# Altium project Flyback converter.PrjPcb
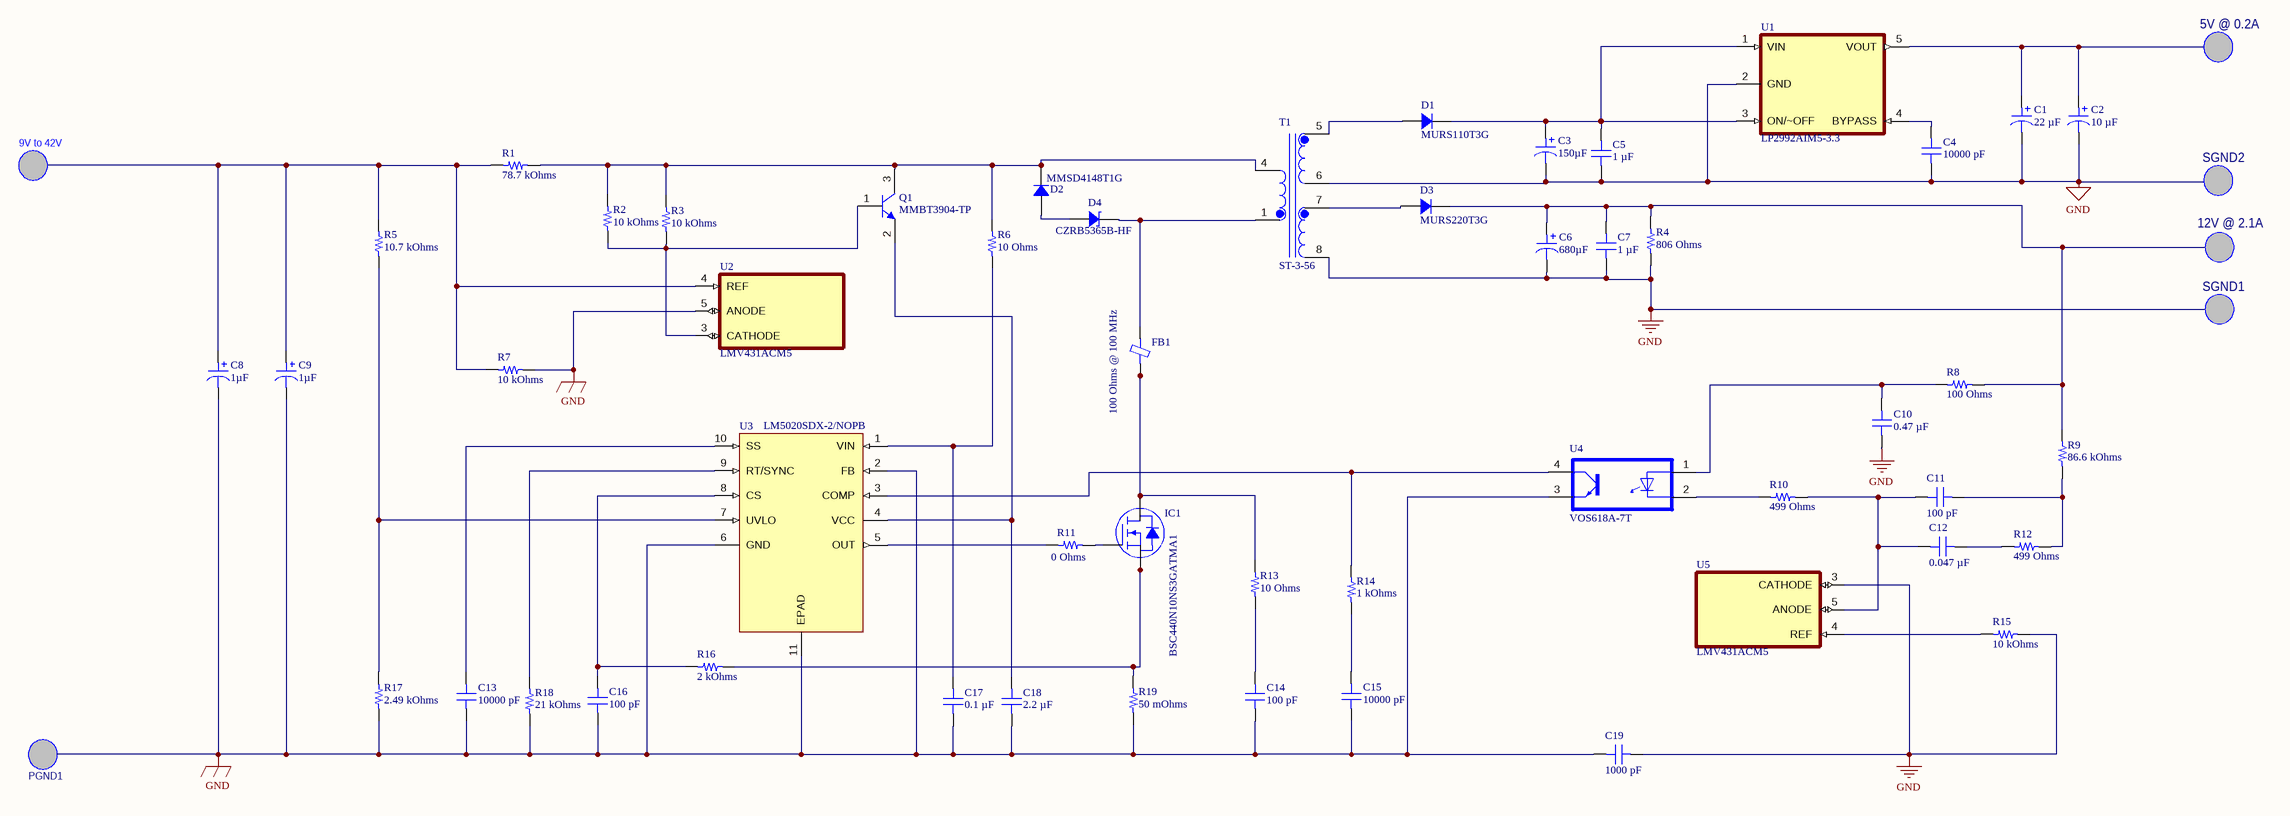
[diagram p0: Flyback Converter SCHEMATIC.SchDoc]
1 sheet, 51 parts. Net scope: global (net labels, ports and power ports of the same name join across sheets).
Board file: Flyback Converter PCB.PcbDoc

## Sheet Flyback Converter SCHEMATIC.SchDoc
size 594 x 420 mm; SheetNumber: 1; SheetTotal: 1

### Parts
C1  22 µF  [CAP AL TH D8 L3.5 H12.5]
C2  10 µF  [CAP AL TH D8 L3.5 H12.5]
C3  150µF  [CAP TH ALUM ELEC D8.00mm S3.50mm H13.00mm]
C4  10000 pF  [CAP 1206_3216 - 0.8MM]
C5  1 µF  [CAP 1206_3216 - 0.8MM]
C6  680µF  [CAP TH ALUM ELEC D10.00mm S5.00mm H14.00mm]
C7  1 µF  [CAP 1206_3216 - 0.8MM]
C8  1µF  [CAP TH ALUM ELEC D5.00mm S2.00mm H12.50mm]
C9  1µF  [CAP TH ALUM ELEC D5.00mm S2.00mm H12.50mm]
C10  0.47 µF  [CAP 1206_3216 - 0.8MM]
C11  100 pF  [CAP 1206_3216 - 0.8MM]
C12  0.047 µF  [CAP 1206_3216 - 0.8MM]
C13  10000 pF  [CAP 1206_3216 - 0.8MM]
C14  100 pF  [CAP 1206_3216 - 0.8MM]
C15  10000 pF  [CAP 1206_3216 - 0.8MM]
C16  100 pF  [CAP 1206_3216 - 0.8MM]
C17  0.1 µF  [CAP 1206_3216 - 0.8MM]
C18  2.2 µF  [CAP 1206_3216 - 0.8MM]
C19  1000 pF  [CAP 1206_3216 - 0.8MM]
D1  MURS110T3G  [DO214AA SMB]
D2  MMSD4148T1G  [SOD-123]
D3  MURS220T3G  [DO214AA SMB]
D4  CZRB5365B-HF  [DO214AA SMB]
FB1  100 Ohms @ 100 MHz  [FER 1206_3216]
IC1  BSC440N10NS3GATMA1  [INFINEON PG-TDSON-8 6.15X5.32MM]
Q1  MMBT3904-TP  [MCCSEMI SOT-23-3]
R1  78.7 kOhms  [RES 1206_3216]
R2  10 kOhms  [RES 1206_3216]
R3  10 kOhms  [RES 1206_3216]
R4  806 Ohms  [RES 1206_3216]
R5  10.7 kOhms  [RES 1206_3216]
R6  10 Ohms  [RES 1206_3216]
R7  10 kOhms  [RES 1206_3216]
R8  100 Ohms  [RES 1206_3216]
R9  86.6 kOhms  [RES 1206_3216]
R10  499 Ohms  [RES 1206_3216]
R11  0 Ohms  [RES 1206_3216]
R12  499 Ohms  [RES 1206_3216]
R13  10 Ohms  [RES 1206_3216]
R14  1 kOhms  [RES 1206_3216]
R15  10 kOhms  [RES 1206_3216]
R16  2 kOhms  [RES 1206_3216]
R17  2.49 kOhms  [RES 1206_3216]
R18  21 kOhms  [RES 1206_3216]
R19  50 mOhms  [RES 1206_3216]
T1  ST-3-56  [flyback tranformer]
U1  LP2992AIM5-3.3  [SOT95P280X145-5N]
U2  LMV431ACM5  [SOT95P280X145-5N]
U3  LM5020SDX-2/NOPB  [DFN400X400X80-11N]
U4  VOS618A-7T  [SOIC127P700X210-4N]
U5  LMV431ACM5  [SOT95P280X145-5N]

### Nets
GND: C1.2 C2.2 C3.2 C4.1 C5.1 C6.2 C7.1 C8.2 C9.2 C10.1 C13.1 C14.1 C15.1 C16.1 C17.1 C18.1 C19.1 C19.2 R4.1 R7.2 R15.1 R17.1 R18.1 R19.1 T1.6 T1.8 U1.2(GND) U2.5(ANODE) U3.2(FB) U3.6(GND) U3.11(EPAD) U4.3(E) U5.3(CATHODE)
NetC1_1: C1.1 C2.1 U1.5(VOUT)
NetC3_1: C3.1 C5.2 D1.2 U1.1(VIN) U1.3(ON/~OFF)
NetC4_2: C4.2 U1.4(BYPASS)
NetC6_1: C6.1 C7.2 D3.2 R4.2 R8.1 R9.2
NetC8_1: C8.1 C9.1 R1.1 R5.2 R7.1 U2.4(REF)
NetC10_2: C10.2 R8.2 U4.1(A)
NetC11_1: C11.1 C12.1 R10.2 U5.5(ANODE)
NetC11_2: C11.2 R9.1 R12.2
NetC12_2: C12.2 R12.1
NetC13_2: C13.2 U3.10(SS)
NetC14_2: C14.2 R13.1
NetC15_2: C15.2 R14.1
NetC16_2: C16.2 R16.1 U3.8(CS)
NetC17_2: C17.2 R6.1 U3.1(VIN)
NetC18_2: C18.2 Q1.2(E) U3.4(VCC)
NetD1_1: D1.1 T1.5
NetD2_1: D2.1 D4.1
NetD2_2: D2.2 Q1.3(C) R1.2 R2.2 R3.2 R6.2 T1.4
NetD3_1: D3.1 T1.7
NetD4_2: D4.2 FB1.2 T1.1
NetFB1_1: FB1.1 IC1.5(D) IC1.6(D) IC1.7(D) IC1.8(D) R13.2
NetIC1_1: IC1.1(S) IC1.2(S) IC1.3(S) R16.2 R19.2
NetIC1_4: IC1.4(G) R11.2
NetQ1_1: Q1.1(B) R2.1 R3.1 U2.3(CATHODE)
NetR5_1: R5.1 R17.2 U3.7(UVLO)
NetR10_1: R10.1 U4.2(C)
NetR11_1: R11.1 U3.5(OUT)
NetR14_2: R14.2 U3.3(COMP) U4.4(CO)
NetR15_2: R15.2 U5.4(REF)
NetR18_2: R18.2 U3.9(RT/SYNC)

### Notes on the sheet
- 5V @ 0.2A
- 9V to 42V
- SGND2
- 12V @ 2.1A
- SGND1
- PGND1
- DWG NO:
- REV:
- THIS DOCUMENT AND THE DATA DISCLOSED HEREIN OR
- HEREWITH IS THE PROPERTY OF ALTIUM LIMITED AND MAY
- BE FREELY DISTRIBUTED IN WHOLE. NO RIGHTS ARE
- RESERVED OR EXPRESS OR IMPLIED WARANTEE GIVEN.
- REVISION
- DESCRIPTION
- DATE
- APPROVED
- ENG:
- APPROVALS
- PROJECT
- DSN:
- CHK:
- REFERENCE DOCUMENTS
- PROJECT REVISION:
- TITLE
- DOCUMENT REVISION:
- DESIGN ITEM:
- BOM:
- FAB DWG:
- PCB DWG:
- ASSY DWG:
- SCALE:
- A2
- SIZE
- CAGE CODE
- FILE NAME
- DWG NO.
- SHEET
- OF
- REV

### Library data of the parts
C1 = UPJ2A220MPD: CAP ALUM 22UF 20% 100V RADIAL; manufacturer: Nichicon; Impedance: 550 mOhms; Lifetime @ Temp.: 3000 Hrs @ 105°C; Polarization: Polar; Ripple Current @ High Frequency: 230 mA @ 10 kHz; Ripple Current @ Low Frequency: 122 mA @ 120 Hz; Part Number: UPJ2A220MPD; Applications: General Purpose; Capacitance: 22 µF; componentlink1description: Datasheet; componentlink1url: http://nichicon-us.com/english/products/pdfs/e-upj.pdf; componentlink2description: DigiKey Link; componentlink2url: https://www.digikey.com/en/products/detail/nichicon/UPJ2A220MPD/2599356; Device Package: Radial, Can; Height - Seated (Max): 0.492" (12.50mm); lastupdated: 27.08.2022 08:22:19; Lead Spacing: 0.138" (3.50mm); Lifecycle Status: Active; Minimum Order: 1; Mounting Type: Through Hole; Operating Temperature: -55°C ~ 105°C; Package / Case: Radial, Can; packaging: Bulk; partid: 7301; Part Status: Active; price: 0.15; series: UPJ; Size / Dimension: 0.315" Dia (8.00mm); Supplier 1: DigiKey; Supplier Part Number 1: 493-15683-ND; Tolerance: ±20%; value: 22 µF; Voltage - Rated: 100 V
C2 = UKL2A100MPD1TD: CAP ALUM 10UF 20% 100V RADIAL; manufacturer: Nichicon; Lifetime @ Temp.: 2000 Hrs @ 85°C; Polarization: Polar; Ripple Current @ High Frequency: 180 mA @ 10 kHz; Ripple Current @ Low Frequency: 90 mA @ 120 Hz; Part Number: UKL2A100MPD1TD; Applications: General Purpose; Capacitance: 10 µF; componentlink1description: Datasheet; componentlink1url: http://nichicon-us.com/english/products/pdfs/e-ukl.pdf; componentlink2description: DigiKey Link; componentlink2url: https://www.digikey.com/en/products/detail/nichicon/UKL2A100MPD1TD/4317213; Device Package: Radial, Can; Height - Seated (Max): 0.492" (12.50mm); lastupdated: 27.08.2022 08:22:20; Lead Spacing: 0.138" (3.50mm); Lifecycle Status: Active; Minimum Order: 1; Mounting Type: Through Hole; Operating Temperature: -40°C ~ 85°C; Package / Case: Radial, Can; packaging: TapeAndBox; partid: 7259; Part Status: Active; price: 0.18; series: UKL; Size / Dimension: 0.315" Dia (8.00mm); Supplier 1: DigiKey; Supplier Part Number 1: 493-10590-1-ND; Tolerance: ±20%; value: 10 µF; Voltage - Rated: 100 V
C3 = EKZE350ELL151MHB5D: CAP ALUM 150UF 20% 35V RADIAL; manufacturer: United Chemi-Con; Impedance: 72 mOhms; Lifetime @ Temp.: 3000 Hrs @ 105°C; Polarization: Polar; Ripple Current @ High Frequency: 760mA @ 100kHz; Ripple Current @ Low Frequency: 304mA @ 120Hz; Part Number: EKZE350ELL151MHB5D; Applications: General Purpose; Capacitance: 150µF; componentlink1description: Datasheet; componentlink1url: http://www.chemi-con.co.jp/cgi-bin/CAT_DB/SEARCH/cat_db_al.cgi?e=e&j=p&pdfname=kze; componentlink2description: DigiKey Link; componentlink2url: http://digikey.com/product-detail/en/united-chemi-con/EKZE350ELL151MHB5D/565-1689-ND/756205; Device Package: Radial, Can; Height - Seated (Max): 0.512" (13.00mm); lastupdated: 7.09.2020 05:24:55; Lead Spacing: 0.138" (3.50mm); Lifecycle Status: Active; Minimum Order: 1; Mounting Type: Through Hole; Operating Temperature: -40°C ~ 105°C; Package / Case: Radial, Can; packaging: Bulk; partid: 24171; Part Status: Active; price: 0.45; series: KZE; Size / Dimension: 0.315" Dia (8.00mm); Supplier 1: DigiKey; Supplier Part Number 1: 565-1689-ND; Tolerance: ±20%; value: 150µF; Voltage - Rated: 35V
C4 C13 C15 = C1206C103K2REC7800: CAP CER 1206 10NF 200V X7R 10%; manufacturer: KEMET; Part Number: C1206C103K2REC7800; Value: 10000 pF; Applications: ESD Protection; Capacitance: 10000 pF; componentlink1description: Datasheet; componentlink1url: https://api.kemet.com/component-edge/download/datasheet/C1206C103K2REC7800.pdf; componentlink2description: DigiKey Link; componentlink2url: https://www.digikey.com/en/products/detail/kemet/C1206C103K2REC7800/8644233; Device Package: 1206 (3216 Metric); lastupdated: 27.08.2022 07:36:50; Lifecycle Status: Active; Minimum Order: 1; Mounting Type: Surface Mount, MLCC; Operating Temperature: -55°C ~ 125°C; Package / Case: 1206 (3216 Metric); packaging: TapeAndReel; partid: 30339; Part Status: Active; price: 0.03; series: ESD SMD Comm X7R; Size / Dimension: 0.126" L x 0.063" W (3.20mm x 1.60mm); Supplier 1: DigiKey; Supplier Part Number 1: 399-C1206C103K2REC7800CT-ND; Temperature Coefficient: X7R; Thickness (Max): 0.035" (0.88mm); Tolerance: ±10%; Voltage - Rated: 200V
C5 C7 = C1206C105K1RACAUTO: CAP CER 1UF 100V X7R 1206; manufacturer: KEMET; Tolerance: ±10%; Part Number: C1206C105K1RACAUTO; Value: 1 µF; Applications: Automotive, Bypass, Decoupling; Capacitance: 1 µF; componentlink1description: Datasheet; componentlink1url: https://api.kemet.com/component-edge/download/datasheet/C1206C105K1RACAUTO.pdf; componentlink2description: DigiKey Link; componentlink2url: https://www.digikey.com/en/products/detail/kemet/C1206C105K1RACAUTO/6108922; Device Package: 1206 (3216 Metric); lastupdated: 27.08.2022 07:37:35; Lifecycle Status: Active; Minimum Order: 1; Mounting Type: Surface Mount, MLCC; Operating Temperature: -55°C ~ 125°C; Package / Case: 1206 (3216 Metric); packaging: TapeAndReel; partid: 45414; Part Status: Active; price: 0.11; Ratings: AEC-Q200; series: SMD Auto X7R; Size / Dimension: 0.126" L x 0.063" W (3.20mm x 1.60mm); Supplier 1: DigiKey; Supplier Part Number 1: 399-13374-1-ND; Temperature Coefficient: X7R; Thickness (Max): 0.071" (1.80mm); Voltage - Rated: 100V
C6 = 25PX680MEFC10X12.5: CAP ALUM 680UF 20% 25V RADIAL; manufacturer: Rubycon; Lifetime @ Temp.: 2000 Hrs @ 105°C; Polarization: Polar; Ripple Current @ High Frequency: 756mA @ 10kHz; Ripple Current @ Low Frequency: 630mA @ 120Hz; Part Number: 25PX680MEFC10X12.5; Applications: General Purpose; Capacitance: 680µF; componentlink1description: Datasheet; componentlink1url: http://www.rubycon.co.jp/en/catalog/e_pdfs/aluminum/e_px.pdf; componentlink2description: DigiKey Link; componentlink2url: http://digikey.com/product-detail/en/rubycon/25PX680MEFC10X12.5/1189-1229-ND/3134185; Device Package: Radial, Can; Height - Seated (Max): 0.551" (14.00mm); lastupdated: 2.09.2020 01:31:12; Lead Spacing: 0.197" (5.00mm); Lifecycle Status: Active; Minimum Order: 1; Mounting Type: Through Hole; Operating Temperature: -55°C ~ 105°C; Package / Case: Radial, Can; packaging: Bulk; partid: 11252; Part Status: Active; price: 0.45; series: PX; Size / Dimension: 0.394" Dia (10.00mm); Supplier 1: DigiKey; Supplier Part Number 1: 1189-1229-ND; Tolerance: ±20%; value: 680µF; Voltage - Rated: 25V
C8 C9 = UVP2A010MDD: CAP ALUM 1UF 20% 100V RADIAL; manufacturer: Nichicon; Lifetime @ Temp.: 2000 Hrs @ 85°C; Polarization: Bi-Polar; Ripple Current @ High Frequency: 42mA @ 10kHz; Ripple Current @ Low Frequency: 21mA @ 120Hz; Part Number: UVP2A010MDD; Applications: General Purpose; Capacitance: 1µF; componentlink1description: Datasheet; componentlink1url: https://products.nichicon.co.jp/en/pdf/XJA043/e-uvp.pdf; componentlink2description: DigiKey Link; componentlink2url: http://digikey.com/product-detail/en/nichicon/UVP2A010MDD/493-16140-ND/2539602; Device Package: Radial, Can; Height - Seated (Max): 0.492" (12.50mm); lastupdated: 4.09.2020 23:28:59; Lead Spacing: 0.079" (2.00mm); Lifecycle Status: Active; Minimum Order: 1; Mounting Type: Through Hole; Operating Temperature: -40°C ~ 85°C; Package / Case: Radial, Can; packaging: Bulk; partid: 21862; Part Status: Active; price: 0.34; series: UVP; Size / Dimension: 0.197" Dia (5.00mm); Supplier 1: DigiKey; Supplier Part Number 1: 493-16140-ND; Tolerance: ±20%; value: 1µF; Voltage - Rated: 100V
C10 = CGA5L2X7R2A474M160AE: CAP CER 0.47UF 100V X7R 1206; manufacturer: TDK Corporation; Tolerance: ±20%; Part Number: CGA5L2X7R2A474M160AE; Value: 0.47 µF; Applications: Automotive, Boardflex Sensitive; Capacitance: 0.47 µF; componentlink1description: Datasheet; componentlink1url: https://product.tdk.com/info/en/catalog/datasheets/mlcc_automotive_soft_en.pdf?ref_disty=digikey; componentlink2description: DigiKey Link; componentlink2url: https://www.digikey.com/en/products/detail/tdk-corporation/CGA5L2X7R2A474M160AE/2782496; Device Package: 1206 (3216 Metric); Features: Soft Termination; lastupdated: 27.08.2022 07:37:39; Lifecycle Status: Active; Minimum Order: 1; Mounting Type: Surface Mount, MLCC; Operating Temperature: -55°C ~ 125°C; Package / Case: 1206 (3216 Metric); packaging: TapeAndReel; partid: 19842; Part Status: Active; price: 0.20; Ratings: AEC-Q200; series: CGA; Size / Dimension: 0.126" L x 0.063" W (3.20mm x 1.60mm); Supplier 1: DigiKey; Supplier Part Number 1: 445-7973-1-ND; Temperature Coefficient: X7R; Thickness (Max): 0.075" (1.90mm); Voltage - Rated: 100V
C11 = C1206C101F1HAC7800: CAP CER 100PF 100V X8R 1206; manufacturer: KEMET; Tolerance: ±1%; Part Number: C1206C101F1HAC7800; Value: 100 pF; Applications: General Purpose; Capacitance: 100 pF; componentlink1description: Datasheet; componentlink1url: https://api.kemet.com/component-edge/download/datasheet/C1206C101F1HAC7800.pdf; componentlink2description: DigiKey Link; componentlink2url: https://www.digikey.com/en/products/detail/kemet/C1206C101F1HAC7800/7949928; Device Package: 1206 (3216 Metric); Features: Low ESL, High Temperature; lastupdated: 27.08.2022 07:36:55; Lifecycle Status: Active; Minimum Order: 1; Mounting Type: Surface Mount, MLCC; Operating Temperature: -55°C ~ 150°C; Package / Case: 1206 (3216 Metric); packaging: TapeAndReel; partid: 30701; Part Status: Active; price: 0.08; series: SMD Comm X8R HT150C; Size / Dimension: 0.126" L x 0.063" W (3.20mm x 1.60mm); Supplier 1: DigiKey; Supplier Part Number 1: 399-C1206C101F1HAC7800CT-ND; Temperature Coefficient: X8R; Thickness (Max): 0.035" (0.88mm); Voltage - Rated: 100V
C12 = C1206C473KAREC7800: CAP CER 1206 47NF 250V X7R 10%; manufacturer: KEMET; Part Number: C1206C473KAREC7800; Value: 0.047 µF; Applications: ESD Protection; Capacitance: 0.047 µF; componentlink1description: Datasheet; componentlink1url: https://api.kemet.com/component-edge/download/datasheet/C1206C473KAREC7800.pdf; componentlink2description: DigiKey Link; componentlink2url: https://www.digikey.com/en/products/detail/kemet/C1206C473KAREC7800/8644251; Device Package: 1206 (3216 Metric); lastupdated: 27.08.2022 07:36:43; Lifecycle Status: Active; Minimum Order: 1; Mounting Type: Surface Mount, MLCC; Operating Temperature: -55°C ~ 125°C; Package / Case: 1206 (3216 Metric); packaging: TapeAndReel; partid: 41573; Part Status: Active; price: 0.04; series: ESD SMD Comm X7R; Size / Dimension: 0.126" L x 0.063" W (3.20mm x 1.60mm); Supplier 1: DigiKey; Supplier Part Number 1: 399-C1206C473KAREC7800CT-ND; Temperature Coefficient: X7R; Thickness (Max): 0.043" (1.10mm); Tolerance: ±10%; Voltage - Rated: 250V
C14 C16 = C1206C101K1GAC7800: CAP CER 100PF 100V C0G/NP0 1206; manufacturer: KEMET; Temperature Coefficient: C0G, NP0; Tolerance: ±10%; Part Number: C1206C101K1GAC7800; Value: 100 pF; Applications: General Purpose; Capacitance: 100 pF; componentlink1description: Datasheet; componentlink1url: https://api.kemet.com/component-edge/download/datasheet/C1206C101K1GACTU.pdf; componentlink2description: DigiKey Link; componentlink2url: https://www.digikey.com/en/products/detail/kemet/C1206C101K1GAC7800/2209794; Device Package: 1206 (3216 Metric); Features: Low ESL; lastupdated: 27.08.2022 07:36:53; Lifecycle Status: Active; Minimum Order: 1; Mounting Type: Surface Mount, MLCC; Operating Temperature: -55°C ~ 125°C; Package / Case: 1206 (3216 Metric); packaging: TapeAndReel; partid: 30528; Part Status: Active; price: 0.08; series: SMD Comm C0G; Size / Dimension: 0.126" L x 0.063" W (3.20mm x 1.60mm); Supplier 1: DigiKey; Supplier Part Number 1: 399-C1206C101K1GAC7800CT-ND; Thickness (Max): 0.035" (0.88mm); Voltage - Rated: 100V
C17 = C1206S104K5RACAUTO: SMD AUTO X7R FE, CERAMIC, 0.1 UF; manufacturer: KEMET; Tolerance: ±10%; Voltage - Rated: 50V; Part Number: C1206S104K5RACAUTO; Value: 0.1 µF; Applications: Automotive, Boardflex Sensitive; Capacitance: 0.1 µF; componentlink1description: Datasheet; componentlink1url: https://api.kemet.com/component-edge/download/datasheet/C1206S104K5RACAUTO.pdf; componentlink2description: DigiKey Link; componentlink2url: https://www.digikey.com/en/products/detail/kemet/C1206S104K5RACAUTO/10232834; Device Package: 1206 (3216 Metric); Features: Floating Electrode; lastupdated: 27.08.2022 07:37:11; Lifecycle Status: Active; Minimum Order: 1; Mounting Type: Surface Mount, MLCC; Operating Temperature: -55°C ~ 125°C; Package / Case: 1206 (3216 Metric); packaging: TapeAndReel; partid: 20853; Part Status: Active; price: 0.10; Ratings: AEC-Q200; series: SMD Auto X7R FE; Size / Dimension: 0.126" L x 0.063" W (3.20mm x 1.60mm); Supplier 1: DigiKey; Supplier Part Number 1: 399-C1206S104K5RACAUTOCT-ND; Temperature Coefficient: X7R; Thickness (Max): 0.035" (0.88mm)
C18 = C1206J225J4RACAUTO: SMD AUTO X7R FO, CERAMIC, 2.2 UF; manufacturer: KEMET; Tolerance: ±5%; Voltage - Rated: 16V; Part Number: C1206J225J4RACAUTO; Value: 2.2 µF; Applications: Automotive, Boardflex Sensitive; Capacitance: 2.2 µF; componentlink1description: Datasheet; componentlink1url: https://content.kemet.com/datasheets/KEM_C1023_X7R_AUTO_SMD.pdf; componentlink2description: DigiKey Link; componentlink2url: https://www.digikey.com/en/products/detail/kemet/C1206J225J4RACAUTO/10232740; Device Package: 1206 (3216 Metric); Features: Open Mode, Soft Termination; lastupdated: 27.08.2022 07:36:51; Lifecycle Status: Active; Minimum Order: 1; Mounting Type: Surface Mount, MLCC; Operating Temperature: -55°C ~ 125°C; Package / Case: 1206 (3216 Metric); packaging: TapeAndReel; partid: 30395; Part Status: Active; price: 0.25; Ratings: AEC-Q200; series: SMD Auto X7R FO; Size / Dimension: 0.126" L x 0.063" W (3.20mm x 1.60mm); Supplier 1: DigiKey; Supplier Part Number 1: 399-C1206J225J4RACAUTOCT-ND; Temperature Coefficient: X7R; Thickness (Max): 0.043" (1.10mm)
C19 = C1206C102G2GECAUTO: CAP CER 1206 1NF 200V C0G 2%; manufacturer: KEMET; Temperature Coefficient: C0G, NP0; Part Number: C1206C102G2GECAUTO; Value: 1000 pF; Applications: Automotive, ESD Protection; Capacitance: 1000 pF; componentlink1description: Datasheet; componentlink1url: https://api.kemet.com/component-edge/download/datasheet/C1206C102G2GECAUTO.pdf; componentlink2description: DigiKey Link; componentlink2url: https://www.digikey.com/en/products/detail/kemet/C1206C102G2GECAUTO/8647606; Device Package: 1206 (3216 Metric); Features: Low ESL; lastupdated: 27.08.2022 07:36:53; Lifecycle Status: Active; Minimum Order: 1; Mounting Type: Surface Mount, MLCC; Operating Temperature: -55°C ~ 125°C; Package / Case: 1206 (3216 Metric); packaging: TapeAndReel; partid: 30577; Part Status: Active; price: 0.35; Ratings: AEC-Q200; series: ESD SMD Auto C0G; Size / Dimension: 0.126" L x 0.063" W (3.20mm x 1.60mm); Supplier 1: DigiKey; Supplier Part Number 1: 399-C1206C102G2GECAUTOCT-ND; Thickness (Max): 0.035" (0.88mm); Tolerance: ±2%; Voltage - Rated: 200V
D1 = MURS110T3G: DIODE GEN PURP 100V 2A SMB; Manufacturer: ON Semiconductor; Current - Reverse Leakage @ Vr: 2µA @ 100V; Diode Type: Standard; Reverse Recovery Time (trr): 35ns; Speed: Fast Recovery =< 500ns, > 200mA (Io); Voltage - Forward (Vf) (Max) @ If: 875mV @ 1A; Part Number: MURS110T3G; ComponentLink1Description: Datasheet; ComponentLink1URL: https://www.onsemi.com/pub/Collateral/MURS120T3-D.PDF; ComponentLink2Description: DigiKey Link; ComponentLink2URL: http://digikey.com/product-detail/en/on-semiconductor/MURS110T3G/MURS110T3GOSCT-ND/1139952; Current - Average Rectified (Io): 2A; LastUpdated: 27.08.2022 08:14:50; Lifecycle Status: Active; Minimum Order: 1; Mounting Type: Surface Mount; Operating Temperature - Junction: -65°C ~ 175°C; Package / Case: DO-214AA, SMB; Packaging: TapeAndReel; PartId: 64; Part Status: Active; Price: 0.11; Series: -; Supplier 1: DigiKey; Supplier Part Number 1: MURS110T3GOSCT-ND; Supplier Device Package: SMB; Voltage - DC Reverse (Vr) (Max): 100V
D2 = MMSD4148T1G: DIODE GEN PURP 100V 200MA SOD123; Manufacturer: ON Semiconductor; Current - Average Rectified (Io): 200mA (DC); Current - Reverse Leakage @ Vr: 5µA @ 75V; Diode Type: Standard; Reverse Recovery Time (trr): 4ns; Speed: Small Signal =< 200mA (Io), Any Speed; Voltage - Forward (Vf) (Max) @ If: 1V @ 10mA; Part Number: MMSD4148T1G; ComponentLink1Description: Datasheet; ComponentLink1URL: http://www.onsemi.com/pub/Collateral/MMSD4148T1-D.PDF; ComponentLink2Description: DigiKey Link; ComponentLink2URL: http://digikey.com/product-detail/en/on-semiconductor/MMSD4148T1G/MMSD4148T1GOSCT-ND/1121611; LastUpdated: 27.08.2022 08:15:29; Lifecycle Status: Active; Minimum Order: 1; Mounting Type: Surface Mount; Operating Temperature - Junction: -55°C ~ 150°C; Package / Case: SOD-123; Packaging: TapeAndReel; PartId: 1001; Part Status: Active; Price: 0.02; Series: -; Supplier 1: DigiKey; Supplier Part Number 1: MMSD4148T1GOSCT-ND; Supplier Device Package: SOD-123; Voltage - DC Reverse (Vr) (Max): 100V
D3 = MURS220T3G: DIODE GEN PURP 200V 2A SMB; Manufacturer: ON Semiconductor; Current - Reverse Leakage @ Vr: 2µA @ 200V; Diode Type: Standard; Reverse Recovery Time (trr): 35ns; Speed: Fast Recovery =< 500ns, > 200mA (Io); Voltage - Forward (Vf) (Max) @ If: 950mV @ 2A; Part Number: MURS220T3G; ComponentLink1Description: Datasheet; ComponentLink1URL: https://www.onsemi.com/pub/Collateral/MURS220T3-D.PDF; ComponentLink2Description: DigiKey Link; ComponentLink2URL: http://digikey.com/product-detail/en/on-semiconductor/MURS220T3G/MURS220T3GOSCT-ND/964578; Current - Average Rectified (Io): 2A; LastUpdated: 27.08.2022 08:14:50; Lifecycle Status: Active; Minimum Order: 1; Mounting Type: Surface Mount; Operating Temperature - Junction: -65°C ~ 175°C; Package / Case: DO-214AA, SMB; Packaging: TapeAndReel; PartId: 60; Part Status: Active; Price: 0.10; Series: -; Supplier 1: DigiKey; Supplier Part Number 1: MURS220T3GOSCT-ND; Supplier Device Package: SMB; Voltage - DC Reverse (Vr) (Max): 200V
D4 = CZRB5365B-HF: DIODE ZENER 36V 5W DO214AA; Manufacturer: Comchip Technology; Current - Reverse Leakage @ Vr: 500 nA @ 27.4 V; Impedance (Max) (Zzt): 11 Ohms; Tolerance: ±5%; Voltage - Forward (Vf) (Max) @ If: 1.2 V @ 200 mA; Part Number: CZRB5365B-HF; ComponentLink1Description: Datasheet; ComponentLink1URL: http://www.comchiptech.com/admin/files/product/CZRB5338B-HF Thru111480. CZRB5388B-HF RevA.pdf; ComponentLink2Description: DigiKey Link; ComponentLink2URL: https://www.digikey.com/en/products/detail/comchip-technology/CZRB5365B-HF/6138926; LastUpdated: 27.08.2022 08:15:45; Lifecycle Status: Active; Minimum Order: 1; Mounting Type: Surface Mount; Operating Temperature: -55°C ~ 150°C; Package / Case: DO-214AA, SMB; Packaging: TapeAndReel; PartId: 1079; Part Status: Active; Power - Max: 5 W; Price: 0.21; Series: -; Supplier 1: DigiKey; Supplier Part Number 1: 641-1815-1-ND; Supplier Device Package: DO-214AA (SMB); Voltage - Zener (Nom) (Vz): 36 V
FB1 = MFBW1V3216-101-R: FIXED IND 100 3000MA 1206; Manufacturer: Eaton - Electronics Division; Current Rating (Max): 3A; DC Resistance (DCR) (Max): 70mOhm; Number of Lines: 1; Part Number: MFBW1V3216-101-R; ComponentLink1Description: Datasheet; ComponentLink1URL: https://www.eaton.com/content/dam/eaton/products/electronic-components/resources/data-sheet/eaton-mfbw1v3216-high-impedance-multilayer-ferrite-chip-bead-data-sheet.pdf; ComponentLink2Description: DigiKey Link; ComponentLink2URL: https://www.digikey.com/en/products/detail/eaton-electronics-division/MFBW1V3216-101-R/13161083; Device Package: 1206 (3216 Metric); Height (Max): 0.043" (1.10mm); Impedance @ Frequency: 100 Ohms @ 100 MHz; LastUpdated: 27.08.2022 08:13:37; Lifecycle Status: Active; Minimum Order: 1; Mounting Type: Surface Mount; Operating Temperature: -40°C ~ 85°C; Package / Case: 1206 (3216 Metric); Packaging: TapeAndReel; PartId: 2694; Part Status: Active; Price: 0.03; Series: MFBW1V3216; Size / Dimension: 0.126" L x 0.063" W (3.20mm x 1.60mm); Supplier 1: DigiKey; Supplier Part Number 1: 283-MFBW1V3216-101-RCT-ND; Value: 100 Ohms @ 100 MHz
IC1 = BSC440N10NS3GATMA1: MOSFET N-CH 100V 5.3A/18A TDSON; Manufacturer: Infineon Technologies; Current - Continuous Drain (Id) @ 25°C: 5.3A (Ta), 18A (Tc); Drive Voltage (Max Rds On,  Min Rds On): 6V, 10V; FET Type: N-Channel; Gate Charge (Qg) (Max) @ Vgs: 10.8 nC @ 10 V; Input Capacitance (Ciss) (Max) @ Vds: 810 pF @ 50 V; Power Dissipation (Max): 29W (Tc); Rds On (Max) @ Id, Vgs: 44mOhm @ 12A, 10V; Vgs (Max): ±20V; Vgs(th) (Max) @ Id: 3.5V @ 12µA; Part Number: BSC440N10NS3GATMA1; ComponentLink1Description: Datasheet; ComponentLink1URL: https://www.infineon.com/dgdl/BSC440N10NS3+Rev2.3.pdf?folderId=db3a304313b8b5a60113cee8763b02d7&fileId=db3a30432239cccd0122604520d47f56; ComponentLink2Description: DigiKey Link; ComponentLink2URL: https://www.digikey.com/en/products/detail/infineon-technologies/BSC440N10NS3GATMA1/2337852; Drain to Source Voltage (Vdss): 100 V; LastUpdated: 27.08.2022 08:30:10; Lifecycle Status: Active; Minimum Order: 1; Mounting Type: Surface Mount; Operating Temperature: -55°C ~ 150°C (TJ); Packaging: TapeAndReel; Part Status: Active; Price: 0.51; Series: OptiMOS™; Supplier 1: DigiKey; Supplier Part Number 1: BSC440N10NS3GATMA1CT-ND; Supplier Device Package: PG-TDSON-8-1; Technology: MOSFET (Metal Oxide)
Q1 = MMBT3904-TP: TRANS NPN 40V 0.2A SOT23; Manufacturer: Micro Commercial Co; Current - Collector Cutoff (Max): 50nA (ICBO); Current - Collector (Ic) (Max): 200 mA; DC Current Gain (hFE) (Min) @ Ic, Vce: 100 @ 10mA, 1V; Frequency - Transition: 300MHz; Power - Max: 350 mW; Vce Saturation (Max) @ Ib, Ic: 300mV @ 5mA, 50mA; Part Number: MMBT3904-TP; ComponentLink1Description: Datasheet; ComponentLink1URL: https://www.mccsemi.com/pdf/Products/MMBT3904(SOT-23).pdf; ComponentLink2Description: DigiKey Link; ComponentLink2URL: https://www.digikey.com/en/products/detail/micro-commercial-co/MMBT3904-TP/717280; LastUpdated: 27.08.2022 08:33:48; Lifecycle Status: Active; Minimum Order: 1; Mounting Type: Surface Mount; Operating Temperature: -55°C ~ 150°C (TJ); Package / Case: TO-236-3, SC-59, SOT-23-3; Packaging: TapeAndReel; PartId: 260; Part Status: Active; Price: 0.02; Series: -; Supplier 1: DigiKey; Supplier Part Number 1: MMBT3904TPMSCT-ND; Supplier Device Package: SOT-23; Transistor Type: NPN; Voltage - Collector Emitter Breakdown (Max): 40 V
R1 = CRCW120678K7FKEA: RES SMD 78.7K OHM 1% 1/4W 1206; Manufacturer: Vishay Dale; Power (Watts): 0.25W, 1/4W; Temperature Coefficient: ±100ppm/°C; Part Number: CRCW120678K7FKEA; ComponentLink1Description: Datasheet; ComponentLink1URL: http://www.vishay.com/docs/20035/dcrcwe3.pdf; ComponentLink2Description: DigiKey Link; ComponentLink2URL: https://www.digikey.com/en/products/detail/vishay-dale/CRCW120678K7FKEA/1176860; Composition: Thick Film; Device Package: 1206 (3216 Metric); Features: Automotive AEC-Q200; Height - Seated (Max): 0.024" (0.60mm); LastUpdated: 27.08.2022 08:00:10; Lifecycle Status: Active; Minimum Order: 1; Number of Terminations: 2; Operating Temperature: -55°C ~ 155°C; Package / Case: 1206 (3216 Metric); Packaging: TapeAndReel; PartId: 44459; Part Status: Active; Price: 0.01; Ratings: AEC-Q200; Resistance: 78.7 kOhms; Series: CRCW; Size / Dimension: 0.126" L x 0.063" W (3.20mm x 1.60mm); Supplier 1: DigiKey; Supplier Part Number 1: 541-78.7KFCT-ND; Supplier Device Package: 1206; Tolerance: ±1%; Value: 78.7 kOhms
R2 R3 R7 R15 = CRG1206F10K: RES SMD 10K OHM 1% 1/4W 1206; Manufacturer: TE Connectivity Passive Product; Power (Watts): 0.25W, 1/4W; Temperature Coefficient: ±100ppm/°C; Part Number: CRG1206F10K; ComponentLink1Description: Datasheet; ComponentLink1URL: https://www.te.com/commerce/DocumentDelivery/DDEController?Action=srchrtrv&DocNm=1773204&DocType=DS&DocLang=English; ComponentLink2Description: DigiKey Link; ComponentLink2URL: https://www.digikey.com/en/products/detail/te-connectivity-passive-product/CRG1206F10K/2389909; Composition: Thick Film; Device Package: 1206 (3216 Metric); Height - Seated (Max): 0.026" (0.65mm); LastUpdated: 27.08.2022 08:00:45; Lifecycle Status: Active; Minimum Order: 1; Number of Terminations: 2; Operating Temperature: -55°C ~ 155°C; Package / Case: 1206 (3216 Metric); Packaging: TapeAndReel; PartId: 26989; Part Status: Active; Price: 0.01; Resistance: 10 kOhms; Series: CRG, Neohm; Size / Dimension: 0.122" L x 0.061" W (3.10mm x 1.55mm); Supplier 1: DigiKey; Supplier Part Number 1: A106069CT-ND; Supplier Device Package: 1206; Tolerance: ±1%; Value: 10 kOhms
R4 = CRCW1206806RFKEA: RES SMD 806 OHM 1% 1/4W 1206; Manufacturer: Vishay Dale; Power (Watts): 0.25W, 1/4W; Temperature Coefficient: ±100ppm/°C; Part Number: CRCW1206806RFKEA; ComponentLink1Description: Datasheet; ComponentLink1URL: http://www.vishay.com/docs/20035/dcrcwe3.pdf; ComponentLink2Description: DigiKey Link; ComponentLink2URL: http://digikey.com/product-detail/en/vishay-dale/CRCW1206806RFKEA/541-806FCT-ND/1181749; Composition: Thick Film; Device Package: 1206 (3216 Metric); Features: Automotive AEC-Q200; Height - Seated (Max): 0.024" (0.60mm); LastUpdated: 27.08.2022 08:00:08; Lifecycle Status: Active; Minimum Order: 1; Number of Terminations: 2; Operating Temperature: -55°C ~ 155°C; Package / Case: 1206 (3216 Metric); Packaging: TapeAndReel; PartId: 44894; Part Status: Active; Price: 0.01; Ratings: AEC-Q200; Resistance: 806 Ohms; Series: CRCW; Size / Dimension: 0.126" L x 0.063" W (3.20mm x 1.60mm); Supplier 1: DigiKey; Supplier Part Number 1: 541-806FCT-ND; Supplier Device Package: 1206; Tolerance: ±1%; Value: 806 Ohms
R5 = RC1206FR-0710K7L: RES 10.7K OHM 1% 1/4W 1206; Manufacturer: Yageo; Power (Watts): 0.25W, 1/4W; Temperature Coefficient: ±100ppm/°C; Part Number: RC1206FR-0710K7L; ComponentLink1Description: Datasheet; ComponentLink1URL: https://www.yageo.com/upload/media/product/productsearch/datasheet/rchip/PYu-RC_Group_51_RoHS_L_10.pdf; ComponentLink2Description: DigiKey Link; ComponentLink2URL: https://www.digikey.com/en/products/detail/yageo/RC1206FR-0710K7L/728490; Composition: Thick Film; Device Package: 1206 (3216 Metric); Features: Moisture Resistant; Height - Seated (Max): 0.026" (0.65mm); LastUpdated: 27.08.2022 08:00:44; Lifecycle Status: Active; Minimum Order: 1; Number of Terminations: 2; Operating Temperature: -55°C ~ 155°C; Package / Case: 1206 (3216 Metric); Packaging: TapeAndReel; PartId: 27099; Part Status: Active; Price: 0.01; Resistance: 10.7 kOhms; Series: RC_L; Size / Dimension: 0.122" L x 0.063" W (3.10mm x 1.60mm); Supplier 1: DigiKey; Supplier Part Number 1: 311-10.7KFRCT-ND; Supplier Device Package: 1206; Tolerance: ±1%; Value: 10.7 kOhms
R6 R13 = CRCW120610R0FKEB: RES SMD 10 OHM 1% 1/4W 1206; Manufacturer: Vishay Dale; Power (Watts): 0.25W, 1/4W; Temperature Coefficient: ±100ppm/°C; Part Number: CRCW120610R0FKEB; ComponentLink1Description: Datasheet; ComponentLink1URL: http://www.vishay.com/docs/20035/dcrcwe3.pdf; ComponentLink2Description: DigiKey Link; ComponentLink2URL: http://digikey.com/product-detail/en/vishay-dale/CRCW120610R0FKEB/541-CRCW120610R0FKEBCT-ND/11500734; Composition: Thick Film; Device Package: 1206 (3216 Metric); Features: Automotive AEC-Q200; LastUpdated: 27.08.2022 07:59:59; Lifecycle Status: Active; Minimum Order: 1; Number of Terminations: 2; Operating Temperature: -55°C ~ 155°C; Package / Case: 1206 (3216 Metric); Packaging: TapeAndReel; PartId: 56965; Price: 0.01; Ratings: AEC-Q200; Resistance: 10 Ohms; Series: CRCW; Supplier 1: DigiKey; Supplier Part Number 1: 541-CRCW120610R0FKEBCT-ND; Supplier Device Package: 1206; Tolerance: ±1%; Value: 10 Ohms
R8 = CRCW1206100RFKEB: RES SMD 100 OHM 1% 1/4W 1206; Manufacturer: Vishay Dale; Power (Watts): 0.25W, 1/4W; Temperature Coefficient: ±100ppm/°C; Part Number: CRCW1206100RFKEB; ComponentLink1Description: Datasheet; ComponentLink1URL: http://www.vishay.com/docs/20035/dcrcwe3.pdf; ComponentLink2Description: DigiKey Link; ComponentLink2URL: https://www.digikey.com/en/products/detail/vishay-dale/CRCW1206100RFKEB/5076280; Composition: Thick Film; Device Package: 1206 (3216 Metric); Features: Automotive AEC-Q200; Height - Seated (Max): 0.024" (0.60mm); LastUpdated: 27.08.2022 07:59:59; Lifecycle Status: Active; Minimum Order: 1; Number of Terminations: 2; Operating Temperature: -55°C ~ 155°C; Package / Case: 1206 (3216 Metric); Packaging: TapeAndReel; PartId: 56951; Part Status: Active; Price: 0.01; Ratings: AEC-Q200; Resistance: 100 Ohms; Series: CRCW; Size / Dimension: 0.126" L x 0.063" W (3.20mm x 1.60mm); Supplier 1: DigiKey; Supplier Part Number 1: 541-CRCW1206100RFKEBCT-ND; Supplier Device Package: 1206; Tolerance: ±1%; Value: 100 Ohms
R9 = CRCW120686K6FKEA: RES SMD 86.6K OHM 1% 1/4W 1206; Manufacturer: Vishay Dale; Power (Watts): 0.25W, 1/4W; Temperature Coefficient: ±100ppm/°C; Part Number: CRCW120686K6FKEA; ComponentLink1Description: Datasheet; ComponentLink1URL: http://www.vishay.com/docs/20035/dcrcwe3.pdf; ComponentLink2Description: DigiKey Link; ComponentLink2URL: https://www.digikey.com/en/products/detail/vishay-dale/CRCW120686K6FKEA/1176865; Composition: Thick Film; Device Package: 1206 (3216 Metric); Features: Automotive AEC-Q200; Height - Seated (Max): 0.024" (0.60mm); LastUpdated: 27.08.2022 08:00:43; Lifecycle Status: Active; Minimum Order: 1; Number of Terminations: 2; Operating Temperature: -55°C ~ 155°C; Package / Case: 1206 (3216 Metric); Packaging: TapeAndReel; PartId: 27592; Part Status: Active; Price: 0.01; Ratings: AEC-Q200; Resistance: 86.6 kOhms; Series: CRCW; Size / Dimension: 0.126" L x 0.063" W (3.20mm x 1.60mm); Supplier 1: DigiKey; Supplier Part Number 1: 541-86.6KFCT-ND; Supplier Device Package: 1206; Tolerance: ±1%; Value: 86.6 kOhms
R10 R12 = CR1206-FX-4990ELF: RES SMD 499 OHM 1% 1/4W 1206; Manufacturer: Bourns Inc.; Power (Watts): 0.25W, 1/4W; Temperature Coefficient: ±100ppm/°C; Part Number: CR1206-FX-4990ELF; ComponentLink1Description: Datasheet; ComponentLink1URL: https://www.bourns.com/docs/Product-Datasheets/CHPREZTR.pdf; ComponentLink2Description: DigiKey Link; ComponentLink2URL: https://www.digikey.com/en/products/detail/bourns-inc/CR1206-FX-4990ELF/2563086; Composition: Thick Film; Device Package: 1206 (3216 Metric); Features: Moisture Resistant; Height - Seated (Max): 0.030" (0.75mm); LastUpdated: 27.08.2022 08:00:42; Lifecycle Status: Active; Minimum Order: 1; Number of Terminations: 2; Operating Temperature: -55°C ~ 155°C; Package / Case: 1206 (3216 Metric); Packaging: TapeAndReel; PartId: 27856; Part Status: Active; Price: 0.01; Resistance: 499 Ohms; Series: CR1206; Size / Dimension: 0.126" L x 0.063" W (3.20mm x 1.60mm); Supplier 1: DigiKey; Supplier Part Number 1: CR1206-FX-4990ELFCT-ND; Supplier Device Package: 1206; Tolerance: ±1%; Value: 499 Ohms
R11 = CRCW12060000ZSTA: RES SMD 0 OHM JUMPER 1/4W 1206; Manufacturer: Vishay Dale; Power (Watts): 0.25W, 1/4W; Part Number: CRCW12060000ZSTA; ComponentLink1Description: Datasheet; ComponentLink1URL: http://www.vishay.com/docs/20008/dcrcw.pdf; ComponentLink2Description: DigiKey Link; ComponentLink2URL: https://www.digikey.com/en/products/detail/vishay-dale/CRCW12060000ZSTA/5076261; Composition: Thick Film; Device Package: 1206 (3216 Metric); Features: Automotive AEC-Q200; Height - Seated (Max): 0.024" (0.60mm); LastUpdated: 27.08.2022 08:00:45; Lifecycle Status: Active; Minimum Order: 1; Number of Terminations: 2; Operating Temperature: -55°C ~ 155°C; Package / Case: 1206 (3216 Metric); Packaging: TapeAndReel; PartId: 26954; Part Status: Active; Price: 0.02; Ratings: AEC-Q200; Resistance: 0 Ohms; Series: CRCW; Size / Dimension: 0.126" L x 0.063" W (3.20mm x 1.60mm); Supplier 1: DigiKey; Supplier Part Number 1: 541-4322-1-ND; Supplier Device Package: 1206; Tolerance: Jumper; Value: 0 Ohms
R14 = CRCW12061K00FKEBC: RES 1K OHM 1% 1/4W 1206; Manufacturer: Vishay Dale; Power (Watts): 0.25W, 1/4W; Temperature Coefficient: ±100ppm/°C; Part Number: CRCW12061K00FKEBC; ComponentLink1Description: Datasheet; ComponentLink1URL: https://www.vishay.com/docs/28773/crcwce3.pdf; ComponentLink2Description: DigiKey Link; ComponentLink2URL: https://www.digikey.com/en/products/detail/vishay-dale/CRCW12061K00FKEBC/7921275; Composition: Thick Film; Device Package: 1206 (3216 Metric); Height - Seated (Max): 0.026" (0.65mm); LastUpdated: 27.08.2022 07:59:49; Lifecycle Status: Active; Minimum Order: 1; Number of Terminations: 2; Operating Temperature: -55°C ~ 155°C; Package / Case: 1206 (3216 Metric); Packaging: TapeAndReel; PartId: 66202; Part Status: Active; Price: 0.01; Resistance: 1 kOhms; Series: CRCW-C; Size / Dimension: 0.120" L x 0.061" W (3.05mm x 1.55mm); Supplier 1: DigiKey; Supplier Part Number 1: 541-CRCW12061K00FKEBCCT-ND; Supplier Device Package: 1206; Tolerance: ±1%; Value: 1 kOhms
R16 = CRCW12062K00FKEA: RES SMD 2K OHM 1% 1/4W 1206; Manufacturer: Vishay Dale; Power (Watts): 0.25W, 1/4W; Temperature Coefficient: ±100ppm/°C; Part Number: CRCW12062K00FKEA; ComponentLink1Description: Datasheet; ComponentLink1URL: http://www.vishay.com/docs/20035/dcrcwe3.pdf; ComponentLink2Description: DigiKey Link; ComponentLink2URL: https://www.digikey.com/en/products/detail/vishay-dale/CRCW12062K00FKEA/1176676; Composition: Thick Film; Device Package: 1206 (3216 Metric); Features: Automotive AEC-Q200; Height - Seated (Max): 0.024" (0.60mm); LastUpdated: 27.08.2022 08:00:37; Lifecycle Status: Active; Minimum Order: 1; Number of Terminations: 2; Operating Temperature: -55°C ~ 155°C; Package / Case: 1206 (3216 Metric); Packaging: TapeAndReel; PartId: 31175; Part Status: Active; Price: 0.01; Ratings: AEC-Q200; Resistance: 2 kOhms; Series: CRCW; Size / Dimension: 0.126" L x 0.063" W (3.20mm x 1.60mm); Supplier 1: DigiKey; Supplier Part Number 1: 541-2.00KFCT-ND; Supplier Device Package: 1206; Tolerance: ±1%; Value: 2 kOhms
R17 = CRCW12062K49FKEA: RES SMD 2.49K OHM 1% 1/4W 1206; Manufacturer: Vishay Dale; Power (Watts): 0.25W, 1/4W; Temperature Coefficient: ±100ppm/°C; Part Number: CRCW12062K49FKEA; ComponentLink1Description: Datasheet; ComponentLink1URL: http://www.vishay.com/docs/20035/dcrcwe3.pdf; ComponentLink2Description: DigiKey Link; ComponentLink2URL: https://www.digikey.com/en/products/detail/vishay-dale/CRCW12062K49FKEA/1176687; Composition: Thick Film; Device Package: 1206 (3216 Metric); Features: Automotive AEC-Q200; Height - Seated (Max): 0.024" (0.60mm); LastUpdated: 27.08.2022 08:00:36; Lifecycle Status: Active; Minimum Order: 1; Number of Terminations: 2; Operating Temperature: -55°C ~ 155°C; Package / Case: 1206 (3216 Metric); Packaging: TapeAndReel; PartId: 31570; Part Status: Active; Price: 0.01; Ratings: AEC-Q200; Resistance: 2.49 kOhms; Series: CRCW; Size / Dimension: 0.126" L x 0.063" W (3.20mm x 1.60mm); Supplier 1: DigiKey; Supplier Part Number 1: 541-2.49KFCT-ND; Supplier Device Package: 1206; Tolerance: ±1%; Value: 2.49 kOhms
R18 = CRCW120621K0FKEA: RES SMD 21K OHM 1% 1/4W 1206; Manufacturer: Vishay Dale; Power (Watts): 0.25W, 1/4W; Temperature Coefficient: ±100ppm/°C; Part Number: CRCW120621K0FKEA; ComponentLink1Description: Datasheet; ComponentLink1URL: http://www.vishay.com/docs/20035/dcrcwe3.pdf; ComponentLink2Description: DigiKey Link; ComponentLink2URL: http://digikey.com/product-detail/en/vishay-dale/CRCW120621K0FKEA/541-21.0KFCT-ND/1181908; Composition: Thick Film; Device Package: 1206 (3216 Metric); Features: Automotive AEC-Q200; Height - Seated (Max): 0.024" (0.60mm); LastUpdated: 27.08.2022 08:00:27; Lifecycle Status: Active; Minimum Order: 1; Number of Terminations: 2; Operating Temperature: -55°C ~ 155°C; Package / Case: 1206 (3216 Metric); Packaging: TapeAndReel; PartId: 36417; Part Status: Active; Price: 0.01; Ratings: AEC-Q200; Resistance: 21 kOhms; Series: CRCW; Size / Dimension: 0.126" L x 0.063" W (3.20mm x 1.60mm); Supplier 1: DigiKey; Supplier Part Number 1: 541-21.0KFCT-ND; Supplier Device Package: 1206; Tolerance: ±1%; Value: 21 kOhms
R19 = RL1206FR-070R05L: RES 0.05 OHM 1% 1/4W 1206; Manufacturer: Yageo; Power (Watts): 0.25W, 1/4W; Temperature Coefficient: ±1000ppm/°C; Part Number: RL1206FR-070R05L; ComponentLink1Description: Datasheet; ComponentLink1URL: http://www.yageo.com/documents/recent/PYu-RL_Group_521_RoHS_L_2.pdf; ComponentLink2Description: DigiKey Link; ComponentLink2URL: https://www.digikey.com/en/products/detail/yageo/RL1206FR-070R05L/3885413; Composition: Thick Film; Device Package: 1206 (3216 Metric); Features: Automotive AEC-Q200, Current Sense, Moisture Resistant; Height - Seated (Max): 0.026" (0.65mm); LastUpdated: 27.08.2022 08:00:45; Lifecycle Status: Active; Minimum Order: 1; Number of Terminations: 2; Operating Temperature: -55°C ~ 155°C; Package / Case: 1206 (3216 Metric); Packaging: TapeAndReel; PartId: 26850; Part Status: Active; Price: 0.09; Ratings: AEC-Q200; Resistance: 50 mOhms; Series: RL; Size / Dimension: 0.122" L x 0.063" W (3.10mm x 1.60mm); Supplier 1: DigiKey; Supplier Part Number 1: 311-.05LWCT-ND; Supplier Device Package: 1206; Tolerance: ±1%; Value: 50 mOhms
T1 = ST-3-56: Split Bobbin Low Power Transformer | 2.4VA Power | 115V Input | 10VCT Output Series; Package: None; Price: None; Value: *; MP: ST-3-56; Availability: Unavailable
U2 U5 = LMV431ACM5: 1%, low-voltage (1.24-V) adjustable precision shunt regulator 5-SOT-23 0 to 70; MF: Texas Instruments; Price: None; Package: SOT-23-5 Texas Instruments; Purchase-URL: https://pricing.snapeda.com/search/part/LMV431ACM5/?ref=eda; MP: LMV431ACM5; Availability: Warning; SnapEDA_Link: https://www.snapeda.com/parts/LMV431ACM5/Texas%20Instruments/view-part/17613/?ref=snap; Check_prices: https://www.snapeda.com/parts/LMV431ACM5/Texas%20Instruments/view-part/17613/?ref=eda; Value: *
U3 = LM5020SDX-2/NOPB: 13-100V Wide Vin, Current Mode PWM Boost, Flyback, Sepic Controller; MF: Texas Instruments; SnapEDA_Link: https://www.snapeda.com/parts/LM5020SDX-2/NOPB/Texas+Instruments/view-part/?ref=snap; Price: None; Check_prices: https://www.snapeda.com/parts/LM5020SDX-2/NOPB/Texas+Instruments/view-part/?ref=eda; Value: *; Package: WSON-10 Texas Instruments; Availability: In Stock; Purchase-URL: https://pricing.snapeda.com/search/part/LM5020SDX-2/NOPB/?ref=eda; MP: LM5020SDX-2/NOPB
U4 = VOS618A-7T: Optoisolator Transistor Output 3750Vrms 1 Channel 4-SSOP; MF: Vishay; Price: None; Package: SSOP-4 Vishay; MP: VOS618A-7T; Value: *; SnapEDA_Link: https://www.snapeda.com/parts/VOS618A-7T/Vishay%20Semiconductor%20Opto%20Division/view-part/697930/?ref=snap; Availability: Unavailable
U1 = LP2992AIM5-3.3: Package: None; Price: None; Value: *; MP: LP2992AIM5-3.3; Availability: Unavailable